# EAGLE schematic BLDC_schematic_v3 (EAGLE 9.6.2)
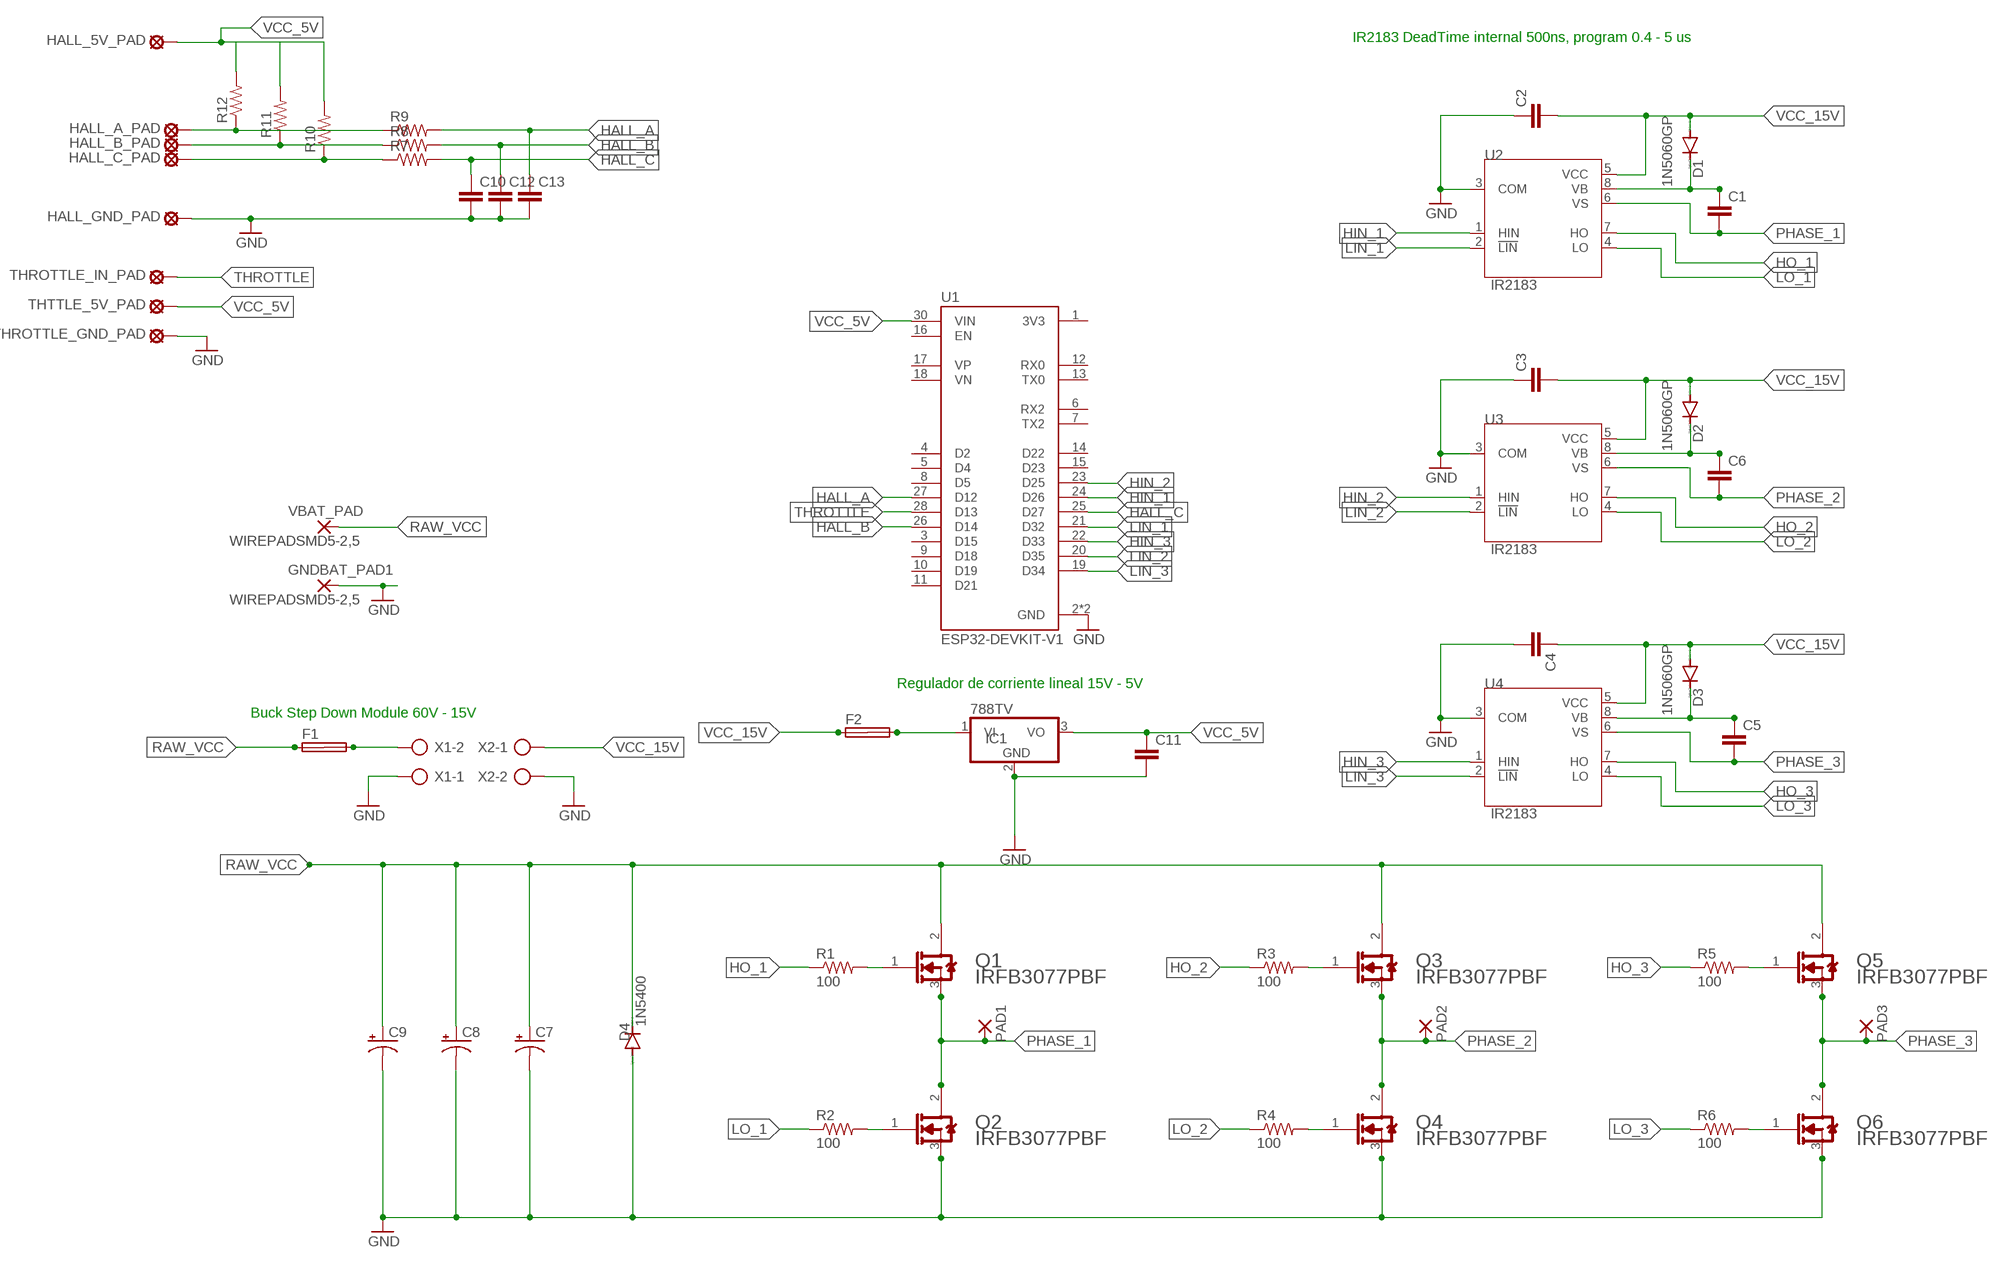
[diagram p0: schematic, sheet 1]

## Parts
C1  C-EU025-030X050  [C025-030X050]
C2  C-EU025-030X050  [C025-030X050]
C3  C-EU025-030X050  [C025-030X050]
C4  C-EU025-030X050  [C025-030X050]
C5  C-EU025-030X050  [C025-030X050]
C6  C-EU025-030X050  [C025-030X050]
C7  CPOL-USTT5D11  [TT5D11]
C8  CPOL-USTT5D11  [TT5D11]
C9  CPOL-USTT5D11  [TT5D11]
C10  C-EU025-030X050  [C025-030X050]
C11  C-EU025-030X050  [C025-030X050]
C12  C-EU025-030X050  [C025-030X050]
C13  C-EU025-030X050  [C025-030X050]
D1  1N5060GP  [DO15-12]
D2  1N5060GP  [DO15-12]
D3  1N5060GP  [DO15-12]
D4  1N5400  [DO201-15]
F1  SHK20Q  [SHK20Q]
F2  SHK20Q  [SHK20Q]
GNDBAT_PAD1  WIREPADSMD5-2,5  [5-2,5]
HALL_5V_PAD  MCS08  [MCS08]
HALL_A_PAD  MCS08  [MCS08]
HALL_B_PAD  MCS08  [MCS08]
HALL_C_PAD  MCS08  [MCS08]
HALL_GND_PAD  MCS08  [MCS08]
IC1  788TV  [TO220V]
PAD1  SMD5  [SMD2,54-5,08]
PAD2  SMD5  [SMD2,54-5,08]
PAD3  SMD5  [SMD2,54-5,08]
Q1  INFINEON_IRFB3077PBFINFINEON_IRFB3077PBF_0_0  [INFINEON_IRFB3077PBF_0]
Q2  INFINEON_IRFB3077PBFINFINEON_IRFB3077PBF_0_0  [INFINEON_IRFB3077PBF_0]
Q3  INFINEON_IRFB3077PBFINFINEON_IRFB3077PBF_0_0  [INFINEON_IRFB3077PBF_0]
Q4  INFINEON_IRFB3077PBFINFINEON_IRFB3077PBF_0_0  [INFINEON_IRFB3077PBF_0]
Q5  INFINEON_IRFB3077PBFINFINEON_IRFB3077PBF_0_0  [INFINEON_IRFB3077PBF_0]
Q6  INFINEON_IRFB3077PBFINFINEON_IRFB3077PBF_0_0  [INFINEON_IRFB3077PBF_0]
R1  100  R-US_0207/10  [0207/10]
R2  100  R-US_0207/10  [0207/10]
R3  100  R-US_0207/10  [0207/10]
R4  100  R-US_0207/10  [0207/10]
R5  100  R-US_0207/10  [0207/10]
R6  100  R-US_0207/10  [0207/10]
R7  R-US_0204/7  [0204/7]
R8  R-US_0204/7  [0204/7]
R9  R-US_0204/7  [0204/7]
R10  R-US_0204/7  [0204/7]
R11  R-US_0204/7  [0204/7]
R12  R-US_0204/7  [0204/7]
THROTTLE_GND_PAD  MCS08  [MCS08]
THROTTLE_IN_PAD  MCS08  [MCS08]
THTTLE_5V_PAD  MCS08  [MCS08]
U1  ESP32-DEVKIT-V1  [MODULE_ESP32_DEVKIT_V1]
U2  IR2183  [DIP762W45P254L1092H533Q8]
U3  IR2183  [DIP762W45P254L1092H533Q8]
U4  IR2183  [DIP762W45P254L1092H533Q8]
VBAT_PAD  WIREPADSMD5-2,5  [5-2,5]
X1  AK500/2-H  [AK500/2-H]
X2  AK500/2-H  [AK500/2-H]

## Nets
GND: C2.1 C3.1 C4.2 C7.- C8.- C9.- C10.2 C12.2 C13.2 D4.A GNDBAT_PAD1.1(P) HALL_GND_PAD.MP Q2.3(S) Q4.3(S) Q6.3(S) THROTTLE_GND_PAD.MP U1.2(GND) U1.29(GND) U2.3(COM) U3.3(COM) U4.3(COM) X1.1 X2.2
HALL_A: C13.1 R9.2 U1.27(D12)
HALL_B: C12.1 R8.2 U1.26(D14)
HALL_C: C10.1 R7.2 U1.25(D27)
HIN_1: U1.24(D26) U2.1(HIN)
HIN_2: U1.23(D25) U3.1(HIN)
HIN_3: U1.22(D33) U4.1(HIN)
HO_1: R1.1 U2.7(HO)
HO_2: R3.1 U3.7(HO)
HO_3: R5.1 U4.7(HO)
LIN_1: U1.21(D32) U2.2(!LIN)
LIN_2: U1.20(D35) U3.2(!LIN)
LIN_3: U1.19(D34) U4.2(!LIN)
LO_1: R2.1 U2.4(LO)
LO_2: R4.1 U3.4(LO)
LO_3: R6.1 U4.4(LO)
N$1: C6.1 D2.C U3.8(VB)
N$2: C5.1 D3.C U4.8(VB)
N$3: C1.1 D1.C U2.8(VB)
N$4: C11.2 IC1.2(GND) ; supply symbol labelled GND
N$5: F1.2A X1.2
N$6: Q3.1(G) R3.2
N$7: Q1.1(G) R1.2
N$8: Q2.1(G) R2.2
N$9: Q4.1(G) R4.2
N$10: F2.1A
N$11: Q5.1(G) R5.2
N$12: Q6.1(G) R6.2
N$13: F2.2A IC1.1(VI)
N$14: HALL_A_PAD.MP R9.1 R12.1
N$15: HALL_B_PAD.MP R8.1 R11.1
N$16: HALL_C_PAD.MP R7.1 R10.1
N$17: F1.1A
N$21: R11.2
N$22: R12.2
PHASE_1: C1.2 PAD1.1(P) Q1.3(S) Q2.2(D) U2.6(VS)
PHASE_2: C6.2 PAD2.1(P) Q3.3(S) Q4.2(D) U3.6(VS)
PHASE_3: C5.2 PAD3.1(P) Q5.3(S) Q6.2(D) U4.6(VS)
RAW_VCC: C7.+ C8.+ C9.+ D4.C Q1.2(D) Q3.2(D) Q5.2(D) VBAT_PAD.1(P)
THROTTLE: THROTTLE_IN_PAD.MP U1.28(D13)
VCC_5V: C11.1 HALL_5V_PAD.MP IC1.3(VO) R10.2 THTTLE_5V_PAD.MP U1.30(VIN)
VCC_15V: C2.2 C3.2 C4.1 D1.A D2.A D3.A U2.5(VCC) U3.5(VCC) U4.5(VCC) X2.1
Unconnected: F1.1B F1.2B F2.1B F2.2B U1.1(3V3) U1.3(D15) U1.4(D2) U1.5(D4) U1.6(RX2) U1.7(TX2) U1.8(D5) U1.9(D18) U1.10(D19) U1.11(D21) U1.12(RX0) U1.13(TX0) U1.14(D22) U1.15(D23) U1.16(EN) U1.17(VP) U1.18(VN)

## Notes on the sheet
- IR2183 DeadTime internal 500ns, program 0.4 - 5 us
- Regulador de corriente lineal 15V - 5V
- Buck Step Down Module 60V - 15V

## Library data of the parts
C1-C6 C10-C13 = rcl:C-EU: CAPACITOR, European symbol; SPICEPREFIX: C
C7-C9 = rcl:CPOL-US: POLARIZED CAPACITOR, American symbol; SPICEPREFIX: C
D1-D3 = diode:1N5060GP: DIODE controlled avalanche rectifier
D4 = diode:1N5400: DIODE standard rectifier, 3 A, 50 V (Motorola)
F1 F2 = fuse:SHK20Q: FUSE HOLDER 5 x 20 mm, SH contact, E1207 Buerklin 64G6061; OC_FARNELL: unknown; OC_NEWARK: unknown
GNDBAT_PAD1 VBAT_PAD = wirepad:WIREPAD: Wire PAD connect wire on PCB
HALL_5V_PAD HALL_A_PAD HALL_B_PAD HALL_C_PAD HALL_GND_PAD THROTTLE_GND_PAD THROTTLE_IN_PAD THTTLE_5V_PAD = solpad:MCS08: SOLDER PAD MC S0,8, drill 1.2 mm, distributor Buerklin, 08F130
IC1 = linear:78*: Positive VOLTAGE REGULATOR Source: http://cache.national.com/ds/LM/LM78L05.pdf http://www.fairchildsemi.com/ds/LM/LM7805.pdf
PAD1-PAD3 = wirepad:SMD5: SMD PAD
Q1-Q6 = Infineon - IRFB3077PBF:INFINEON_IRFB3077PBF: N-Channel 75 V 120A (Tc) 370W (Tc) Through Hole TO-220AB; AUTOMOTIVE: No; CENTROID_NOT_SPECIFIED: No; CONTINUOUS_DRAIN_CURRENT: 210A; DATASHEET: https://www.infineon.com/dgdl/Infineon-IRFB3077-DataSheet-v01_01-EN.pdf?fileId=5546d462533600a4015356153f0d1def; DEPLETION_MODE: False; DEVICE_CLASS_L1: Discrete Semiconductors; DEVICE_CLASS_L2: Transistors; DEVICE_CLASS_L3: MOSFETs; DIGIKEY_DESCRIPTION: MOSFET N-CH 75V 120A TO220AB; DIGIKEY_PART_NUMBER: IRFB3077PBF-ND; DRAIN_TO_SOURCE_BREAKDOWN_VOLTAGE: 75V; DRAIN_TO_SOURCE_RESISTANCE: 2.8mΩ; DRAIN_TO_SOURCE_VOLTAGE: 75V; FOOTPRINT_URL: https://www.infineon.com/cms/en/product/packages/PG-TO220/PG-TO220-3-904/; FOOTPRINT_VARIANT_NAME_0: Recommended_Land_Pattern; GATE_CHARGE_AT_VGS: 160nC @ 10V; GATE_TO_SOURCE_VOLTAGE: 20V; HEIGHT: 19.15mm; INPUT_CAPACITACE_AT_VDS: 9400pF @ 50V; LEAD_FREE: Yes; MAX_FORWARD_DIODE_VOLTAGE: 1.3V; MAX_JUNCTION_TEMP: +175°C; MF: Infineon; MFG_PACKAGE_IDENT: PG-TO220-3; MFG_PACKAGE_IDENT_COMPONENT_ID: 23a5373a371ebf18; MFG_PACKAGE_IDENT_DATE: 0; MFG_PACKAGE_IDENT_REV: 904; MOUSER_PART_NUMBER: 942-IRFB3077PBF; MPN: IRFB3077PBF; NUMBER_OF_CHANNELS: 1; NUMBER_OF_N_CHANNELS: 1; PACKAGE: TO-220AB; POWER_DISSIPATION: 370W; PREFIX: Q; PULSE_DRAIN_CURRENT: 850A; REVERSE_RECOVERY_CHARGE: 59nC; REVERSE_RECOVERY_TIME: 42ns; ROHS: Yes; RTHJA_MAX: 62°C/W; STANDOFF_HEIGHT: 3.56mm; TECHNOLOGY: NA; TEMPERATURE_RANGE_HIGH: +175°C; TEMPERATURE_RANGE_LOW: -55°C; THRESHOLD_VGS_MAX: 4V; THRESHOLD_VGS_MIN: 2V; TURN_OFF_DELAY_TIME: 69ns; TURN_ON_DELAY_TIME: 25ns; VERIFICATION_VERSION: 0.0.0.3
R1-R12 = rcl:R-US_: RESISTOR, American symbol; SPICEPREFIX: R
U1 = ESP32-DEVKIT-V1:ESP32-DEVKIT-V1: Dual core, Wi-Fi: 2.4 GHz up to 150 Mbits/s,BLE (Bluetooth Low Energy) and legacy Bluetooth, 32 bits, Up to 240 MHz Check availability <https://pricing.snapeda.com/parts/ESP32-DEVKIT-V1/Do%20it/view-part?ref=eda>; AVAILABILITY: Not in stock; DESCRIPTION: Dual core, Wi-Fi: 2.4 GHz up to 150 Mbits/s,BLE (Bluetooth Low Energy) and legacy Bluetooth, 32 bits, Up to 240 MHz; MF: Do it; MP: ESP32-DEVKIT-V1; PACKAGE: None; PRICE: None
U2-U4 = IR2183:IR2183: MOSFET DRVR 600V 2.3A 2-OUT Hi/Lo Side Half Brdg Inv/Non-Inv 8-Pin PDIP Check availability <https://pricing.snapeda.com/parts/IR2183/Infineon/view-part?ref=eda>; AVAILABILITY: In Stock; DESCRIPTION: Half-Bridge Gate Driver IC Inverting, Non-Inverting 14-SOIC; MF: Infineon; MP: IR2183; PACKAGE: DIP-8 International Rectifier; PRICE: None; PURCHASE-URL: https://pricing.snapeda.com/search/part/IR2183/?ref=eda
X1 X2 = con-ptr500:AK500/2-H: CONNECTOR Aug. 2004 / PTR Meßtechnik: Die Bezeichnung der Serie AK505 wurde geändert. Es handelt sich hierbei um AK500 in horizontaler Ausführung.; OC_FARNELL: unknown; OC_NEWARK: unknown

## Module HOLE
Ports: 

### Library data of the parts

## Net classes
0 default: clearance 0.205 mm